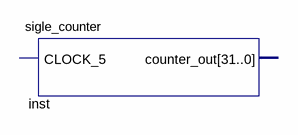
[diagram p0: schematic sheet]
// Quartus schematic single_counter.bdf as structural Verilog: 1 symbols, 0 pins
module single_counter (
);

  sigle_counter inst ();  // open: CLOCK_5, counter_out
endmodule
